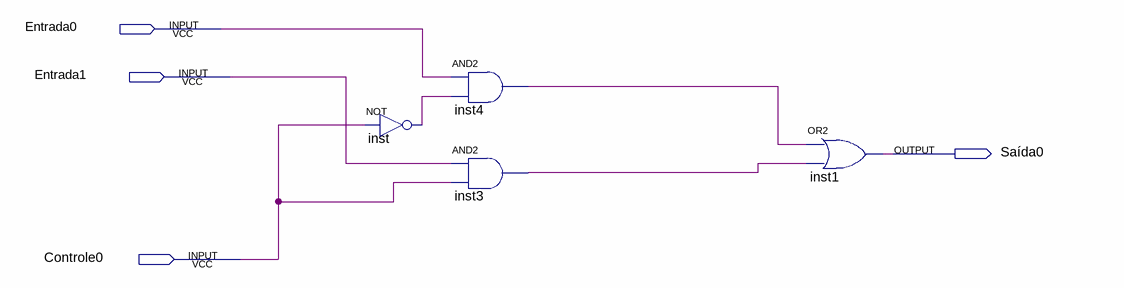
[diagram p0: schematic sheet]
// Quartus schematic mux2x1.bdf as structural Verilog: 4 symbols, 4 pins
module mux2x1 (
  input  Entrada0,
  input  Entrada1,
  input  Controle0,
  output \Saída0 
);

  wire inst3_out, inst4_out, inst_out;

  not inst (inst_out, Controle0);
  and inst4 (inst4_out, Entrada0, inst_out);
  and inst3 (inst3_out, Entrada1, Controle0);
  or inst1 (\Saída0 , inst4_out, inst3_out);
endmodule
